# EAGLE design mainboard (EAGLE 8.2.2)
DATABASE: ./../../../../../Components/TinyCircuits_Part_Database.txt
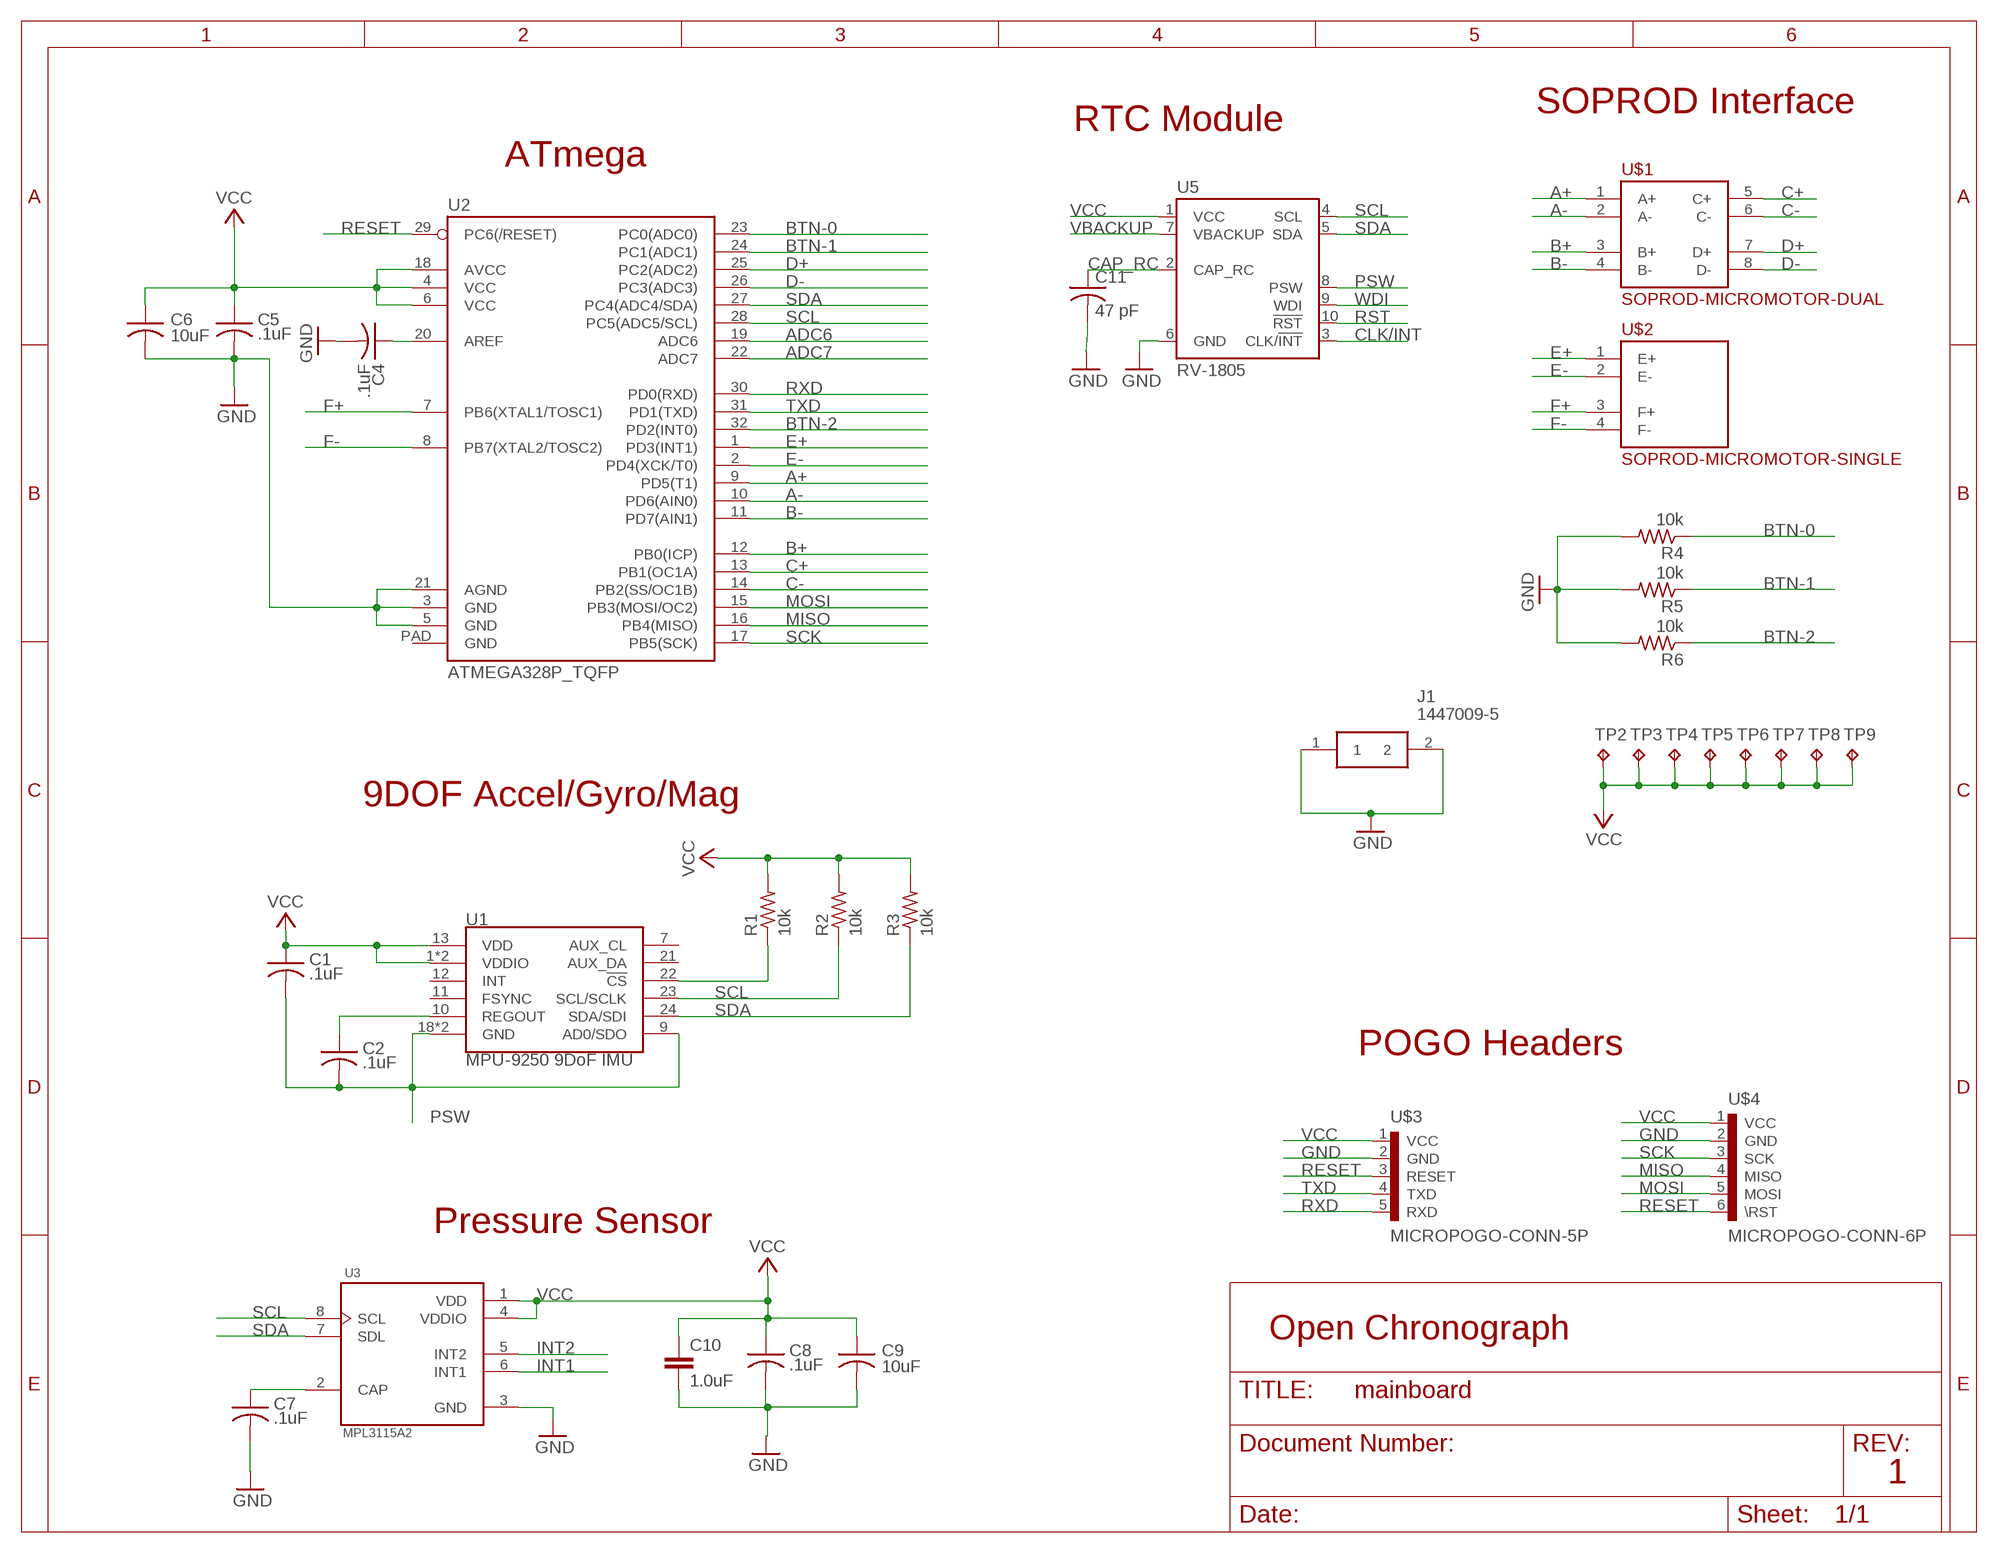
[diagram p0: schematic, sheet 1]

## Parts
C1  .1uF  AS-ITM-00008  [C0402]
C2  .1uF  AS-ITM-00008  [C0402]
C4  .1uF  AS-ITM-00008  [C0402]
C5  .1uF  AS-ITM-00008  [C0402]
C6  10uF  AS-ITM-00002  [C0603]
C7  .1uF  AS-ITM-00008  [C0402]
C8  .1uF  AS-ITM-00008  [C0402]
C9  10uF  AS-ITM-00002  [C0603]
C10  1.0uF  1.0UF-0402-16V-10%  [0402]
C11  47 pF  C-USC0402  [C0402]
J1  1447009-5  [14470095]
R1  10k  R-US_R0402  [R0402]
R2  10k  R-US_R0402  [R0402]
R3  10k  R-US_R0402  [R0402]
R4  10k  R-US_R0402  [R0402]
R5  10k  R-US_R0402  [R0402]
R6  10k  R-US_R0402  [R0402]
TP2  TPTP15SQ  [TP15SQ]
TP3  TPTP15SQ  [TP15SQ]
TP4  TPTP15SQ  [TP15SQ]
TP5  TPTP15SQ  [TP15SQ]
TP6  TPTP15SQ  [TP15SQ]
TP7  TPTP15SQ  [TP15SQ]
TP8  TPTP15SQ  [TP15SQ]
TP9  TPTP15SQ  [TP15SQ]
U1  MPU-9250 9DoF IMU  MPU-9250  [QFN24-3X3]
U2  ATMEGA328P_TQFP  ATMEGA328P_MLFMLF32  [MLF32-PAD]
U3  MPL3115A2  [PSON125P300X500X120-8N]
U5  RV-1805  [RV-1805]
U$1  SOPROD-MICROMOTOR-DUAL  [SOPROD-DUAL]
U$2  SOPROD-MICROMOTOR-SINGLE  [SOPROD-SINGLE]
U$3  MICROPOGO-CONN-5P  [MICROPOGO-CONN-5P-ASYM]
U$4  MICROPOGO-CONN-6P  [MICROPOGO-CONN-6P-ASYM]

## Nets
A+: U2.9(PD5(T1)) U$1.1(A+)
A-: U2.10(PD6(AIN0)) U$1.2(A-)
ADC6: U2.19(ADC6)
ADC7: U2.22(ADC7)
AREF: C4.1 U2.20(AREF)
B+: U2.12(PB0(ICP)) U$1.3(B+)
B-: U2.11(PD7(AIN1)) U$1.4(B-)
BTN-0: R4.1 U2.23(PC0(ADC0))
BTN-1: R5.1 U2.24(PC1(ADC1))
BTN-2: R6.1 U2.32(PD2(INT0))
C+: U2.13(PB1(OC1A)) U$1.5(C+)
C-: U2.14(PB2(SS/OC1B)) U$1.6(C-)
CAP: C7.1 U3.2(CAP)
CAP_RC: C11.1 U5.2(CAP_RC)
CLK/INT: U5.3(CLK/!INT)
D+: U2.25(PC2(ADC2)) U$1.7(D+)
D-: U2.26(PC3(ADC3)) U$1.8(D-)
E+: U2.1(PD3(INT1)) U$2.1(E+)
E-: U2.2(PD4(XCK/T0)) U$2.2(E-)
F+: U2.7(PB6(XTAL1/TOSC1)) U$2.3(F+)
F-: U2.8(PB7(XTAL2/TOSC2)) U$2.4(F-)
GND: C4.2 C5.2 C6.2 C7.2 C8.2 C9.2 C10.2 C11.2 J1.1 J1.2 R4.2 R5.2 R6.2 U2.3(GND) U2.5(GND) U2.21(AGND) U3.3(GND) U5.6(GND) U$3.2(GND) U$4.2(GND)
INT1: U3.6(INT1)
INT2: U3.5(INT2)
MISO: U2.16(PB4(MISO)) U$4.4(MISO)
MOSI: U2.15(PB3(MOSI/OC2)) U$4.5(MOSI)
N$2: C2.1 U1.10(REGOUT)
N$4: R1.1 U1.22(!CS)
PSW: C1.2 C2.2 U1.9(AD0/SDO) U1.18(GND) U1.20(GND) U5.8(PSW)
RESET: U2.29(PC6(/RESET)) U$3.3(RESET) U$4.6(\RST)
RST: U5.10(!RST)
RXD: U2.30(PD0(RXD)) U$3.5(RXD)
SCK: U2.17(PB5(SCK)) U$4.3(SCK)
SCL: R2.1 U1.23(SCL/SCLK) U2.28(PC5(ADC5/SCL)) U3.8(SCL) U5.4(SCL)
SDA: R3.1 U1.24(SDA/SDI) U2.27(PC4(ADC4/SDA)) U3.7(SDL) U5.5(SDA)
TXD: U2.31(PD1(TXD)) U$3.4(TXD)
VBACKUP: U5.7(VBACKUP)
VCC: C1.1 C5.1 C6.1 C8.1 C9.1 C10.1 R1.2 R2.2 R3.2 TP2.TP TP3.TP TP4.TP TP5.TP TP6.TP TP7.TP TP8.TP TP9.TP U1.1(VDDIO) U1.8(VDDIO) U1.13(VDD) U2.4(VCC) U2.6(VCC) U2.18(AVCC) U3.1(VDD) U3.4(VDDIO) U5.1(VCC) U$3.1(VCC) U$4.1(VCC)
WDI: U5.9(WDI)
Unconnected: U1.7(AUX_CL) U1.11(FSYNC) U1.12(INT) U1.21(AUX_DA) U2.PAD(GND)

## Notes on the sheet
- SOPROD Interface
- RTC Module
- ATmega
- 9DOF Accel/Gyro/Mag
- POGO Headers
- Pressure Sensor
- Open Chronograph
- 1

## Library data of the parts
C1 C2 C4 C5 C7 C8 = tinycircuits:AS-ITM-00008: CAP CER 0.1UF 10V 10% X5R 0402; PARTNO: AS-ITM-00008; VALUE: 0.1uF
C6 C9 = tinycircuits:AS-ITM-00002: CAP CER 10UF 10V 20% X5R 0603; PARTNO: AS-ITM-00002
C10 = SparkFun-Capacitors:1.0UF: 1µF ceramic capacitors A capacitor is a passive two-terminal electrical component used to store electrical energy temporarily in an electric field.; PROD_ID: CAP-12417
C11 = adafruit:C-US: CAPACITOR, American symbol
J1 = SamacSys_Parts:1447009-5: EMI Gaskets, Sheets, Absorbers & Shielding 2mm SPRING FINGER Source: Datasheet <https://componentsearchengine.com/Datasheets/1/1447009-5.pdf>; DESCRIPTION: EMI Gaskets, Sheets, Absorbers & Shielding 2mm SPRING FINGER; HEIGHT: 0.9mm; MANUFACTURER_NAME: TE Connectivity; MANUFACTURER_PART_NUMBER: 1447009-5; MOUSER_PART_NUMBER: 571-1447009-5; MOUSER_PRICE-STOCK: https://www.mouser.com/Search/Refine.aspx?Keyword=571-1447009-5
R1-R6 = resistor:R-US_: RESISTOR, American symbol
TP2-TP9 = testpad:TP: Test pad
U1 = SparkFun-Sensors:MPU-9250: MPU-9250 9 Degree of Freedom IMU System in Package that contains MPU-6500 & AK8963 NC pin 19. 2-6 & 14-17 not internally connected. May be used for PCB trace routing. Datasheet <https://cdn.sparkfun.com/assets/learn_tutorials/5/5/0/MPU9250REV1.0.pdf> SparkFun Products: SparkFun 9DoF Razor IMU M0 <https://www.sparkfun.com/products/14001> SparkFun IMU Breakout - MPU-9250 <https://www.sparkfun.com/products/13762>; PROD_ID: IC-13192; VALUE: 9DoF IMU
U2 = SparkFun-IC-Microcontroller:ATMEGA328P_MLF: Datasheet SparkFun Products () () 32-Pin Atmega328 part Commonly used on Arduino compatible boards Available in QFP and QFN packages TQFP is IC-09069 QFN is non-stock
U3 = Common-Parts-Library-Eagle:MPL3115A2: Pressure Sensor, 50-110kpa, Lga-8; MANUFACTURER: Freescale Semiconductor
U5 = SparkFun-Clocks:RV-1805: Micro Crystal Switzerland - RV-1805-C3 - Extremely low power RTC module This RTC IC has been specially designed for ultimate low current consumption of typically 60 nA @ VDD 3.0V for 32.768 kHz XTAL mode. Additionally, there is an RC-Mode consuming only 17nA and an autocalibrated RC-mode consuming 22nA which permits to operate this RTC module several hours at Backup Supply Voltage using low-cost MLCC. The very small SMT ceramic-package combines the 32.768 kHz crystal unit with the CMOS-based oscillator and real-time-clock IC.; PROD_ID: IC-13900
U$1 = OpenChronograph:SOPROD-MICROMOTOR-DUAL
U$2 = OpenChronograph:SOPROD-MICROMOTOR-SINGLE
U$3 = MicroPogo:MICROPOGO-CONN-5P
U$4 = MicroPogo:MICROPOGO-CONN-6P

## Board
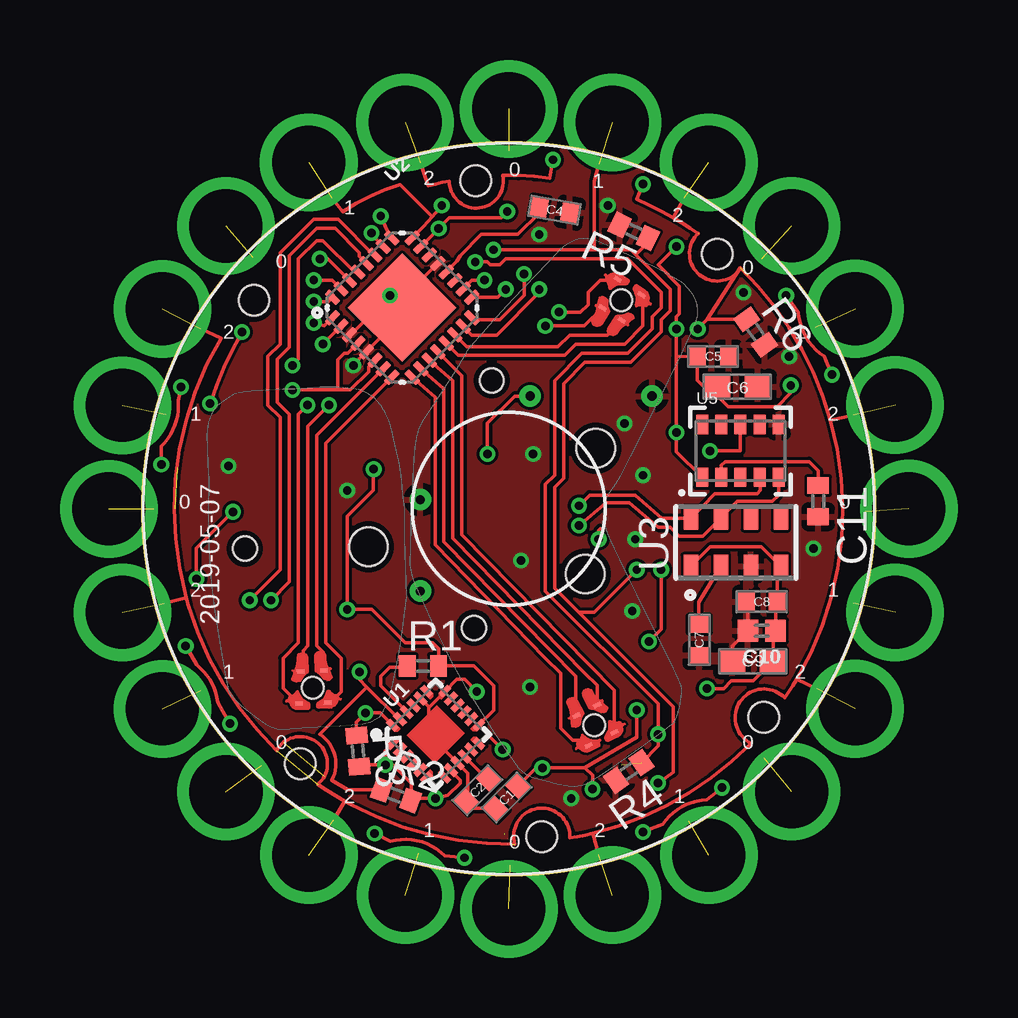
[diagram p1: board, top side]
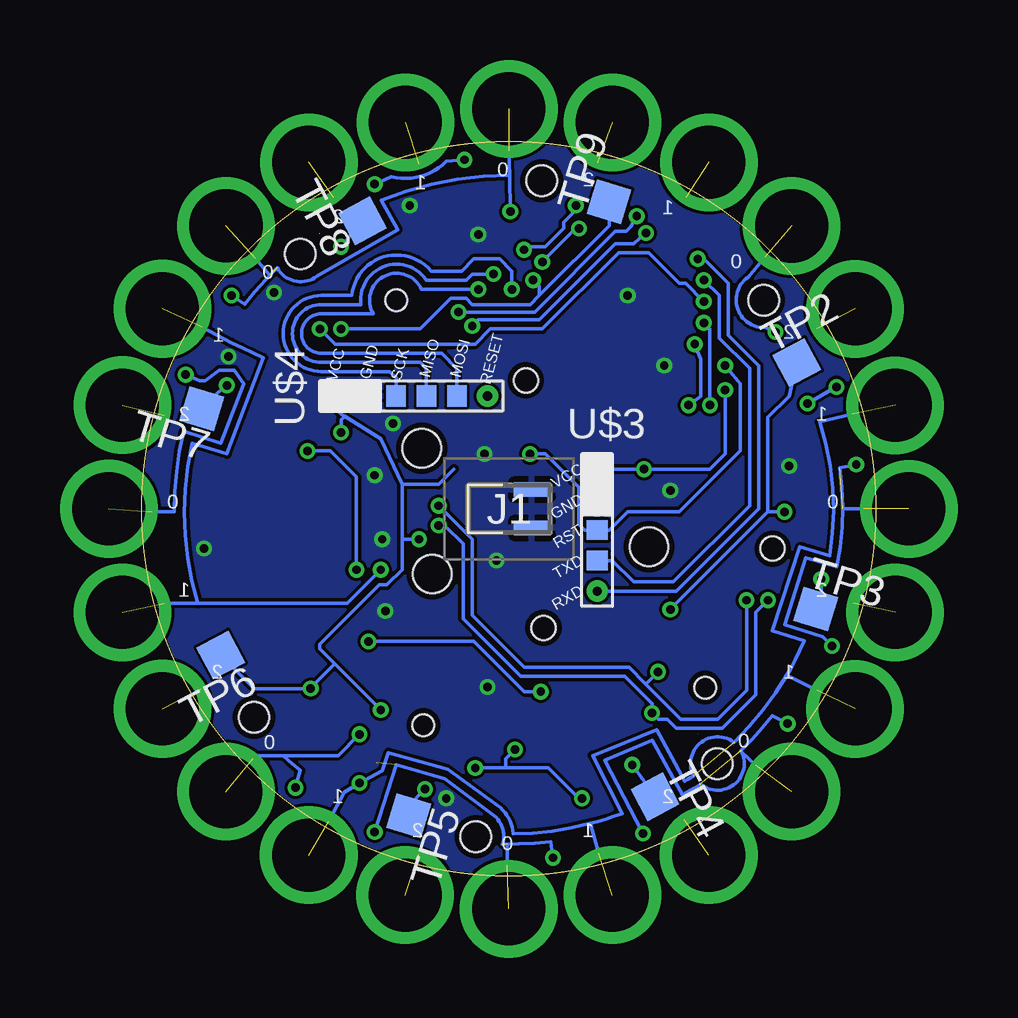
[diagram p2: board, bottom side, seen from below]

No outline drawn. Coordinates in mm, seen from the top.
Copper layers (1*16): Top 0.035mm / dielectric 1.5mm / Bottom 0.035mm
Design rules "dirt_cheap_dirty_boards.v1": minimum track width 5mil, minimum drill 12mil, track to track 5mil, track to pad 5mil, pad to pad 5mil, via to via 5mil, smd to smd 0mil, copper to edge 10mil, drill to drill 10mil, minimum pad ring 10mil, minimum via ring 6mil, stop-mask expansion 2mil, vias tented up to drill 25mil, thermal gap 10mil
Holes 1.27 mm at 25.2,27.13 15.14,30.18 5.89,25.2 7.82,5.89 17.88,2.84 27.13,7.82
bKeepout: area 1.3,1.3 to 31.8,31.8
tRestrict: area 1.3,1.3 to 31.8,31.8
bRestrict: area 1.2,1.2 to 31.8,31.8; area 1.2,1.2 to 31.8,31.8
Milling: area 1.2,1.2 to 31.8,31.8

### Footprints (pad centres in the part's own frame; a part is rotated, then mirrored left to right if it is on the bottom)
C0402 = smd 0.7 x 0.9: 1 -0.65,0; 2 0.65,0
C0603 = smd 1.1 x 1: 1 -0.85,0; 2 0.85,0
0402 = smd 0.85 x 0.9: 1 -0.58,0; 2 0.58,0
14470095 = smd 1.5 x 0.6: 1 -0.75,0.8; 2 -0.75,-0.8
R0402 = smd 0.7 x 0.9: 1 -0.65,0; 2 0.65,0
TP15SQ = smd 1.5 x 1.5: TP 0,0
QFN24-3X3 = smd 0.495 x 0.25: 1 -1.552,1; 6 -1.552,-1; 13 1.552,-1; 18 1.552,1 | smd 0.6 x 0.25: 2 -1.5,0.6; 3 -1.5,0.2; 4 -1.5,-0.2; 5 -1.5,-0.6; 14 1.5,-0.6; 15 1.5,-0.2; 16 1.5,0.2; 17 1.5,0.6 | smd 0.25 x 0.495: 7 -1,-1.552; 12 1,-1.552; 19 1,1.552; 24 -1,1.552 | smd 0.25 x 0.6: 8 -0.6,-1.5; 9 -0.2,-1.5; 10 0.2,-1.5; 11 0.6,-1.5; 20 0.6,1.5; 21 0.2,1.5; 22 -0.2,1.5; 23 -0.6,1.5
MLF32-PAD = smd 0.7 x 0.3: 1 -2.35,1.75; 2 -2.35,1.25; 3 -2.35,0.75; 4 -2.35,0.25; 5 -2.35,-0.25; 6 -2.35,-0.75; 7 -2.35,-1.25; 8 -2.35,-1.75; 17 2.35,-1.75; 18 2.35,-1.25; 19 2.35,-0.75; 20 2.35,-0.25; 21 2.35,0.25; 22 2.35,0.75; 23 2.35,1.25; 24 2.35,1.75 | smd 0.3 x 0.7: 9 -1.75,-2.35; 10 -1.25,-2.35; 11 -0.75,-2.35; 12 -0.25,-2.35; 13 0.25,-2.35; 14 0.75,-2.35; 15 1.25,-2.35; 16 1.75,-2.35; 25 1.75,2.35; 26 1.25,2.35; 27 0.75,2.35; 28 0.25,2.35; 29 -0.25,2.35; 30 -0.75,2.35; 31 -1.25,2.35; 32 -1.75,2.35 | smd 3.2 x 3.2: PAD 0,0
PSON125P300X500X120-8N = smd 0.95 x 0.6: 1 -1,1.875; 2 -1,0.625; 3 -1,-0.625; 4 -1,-1.875; 5 1,-1.875; 6 1,-0.625; 7 1,0.625; 8 1,1.875
RV-1805 = smd 0.5 x 0.8: 1 -1.6,-1.1; 2 -0.8,-1.1; 3 0,-1.1; 4 0.8,-1.1; 5 1.6,-1.1; 6 1.6,1.1; 7 0.8,1.1; 8 0,1.1; 9 -0.8,1.1; 10 -1.6,1.1 | smd 0 x 0: 11 0,0
SOPROD-DUAL = smd 0.305 x 0.152: 1 -0.58,-0.65; 2 -0.47,0.69; 3 0.61,-0.65; 4 0.49,0.69 | smd 0.305 x 0.152 rotated 120: 5 9.903,15.083; 6 8.687,14.508; 7 9.308,16.113; 8 8.207,15.339 | hole 0.9: 0,0; 9.04,15.26 | hole 1.6: 2.533,5.783; 5.3,10.25 | hole 1: 2.723,14.74; -2.617,5.883
SOPROD-SINGLE = smd 0.305 x 0.152: 1 -1.206,-9.468; 2 -1.096,-8.128; 3 -0.136,-8.128; 4 -0.016,-9.468 | hole 0.9: -0.626,-8.818 | hole 1.6: 1.907,-3.035 | hole 1: -3.243,-2.935
MICROPOGO-CONN-5P-ASYM = smd 0.889 x 0.813: 1 0,0; 3 0,-2.54; 4 0,-3.81 | drill 0.381: 2 0,-1.27; 5 0,-5.08
MICROPOGO-CONN-6P-ASYM = smd 0.889 x 0.813: 1 0,3.81; 3 0,1.27; 4 0,0; 5 0,-1.27 | drill 0.381: 2 0,2.54; 6 0,-2.54

### Placement (x,y rotation side)
C1  16.42,4.48 225 top
C2  15.2,4.79 225 top
C4  18.41,28.96 350 top
C5  25.02,22.86 0 top
C6  26.04,21.59 0 top
C7  24.45,11.05 270 top
C8  27.05,12.64 180 top
C9  26.67,10.16 180 top
C10  27.05,11.43 180 top
C11  29.4,16.83 270 top
J1  14.8,16.51 0 bottom
R1  12.93,9.96 0 top
R2  11.81,4.57 340 top
R3  10.22,6.41 275 top
R4  21.51,5.56 215 top
R5  21.72,28.07 155 top
R6  26.8,23.88 305 top
TP2  4.51,22.61 28 bottom
TP3  3.71,12.33 343 bottom
TP4  10.41,4.51 298 bottom
TP5  20.69,3.71 253 bottom
TP6  28.51,10.41 208 bottom
TP7  29.31,20.69 163 bottom
TP8  22.61,28.51 118 bottom
TP9  12.33,29.31 73 bottom
U1  13.46,7.11 45 top
U2  12.06,24.89 45 top
U3  25.97,15.11 90 top
U5  26.16,18.92 0 top
U$1  20.07,7.49 27 top
U$2  8.65,17.89 2 top
U$3  12.83,18.16 0 bottom
U$4  19.94,21.21 90 bottom

### Tracks (layer width: path | path; a pad name or v marks a point on that pad's centre or on a via)
A+
  Top 0.152: 19.88,6.67 20.31,6.86 | 19.88,6.67 U$1.1 | U2.9 13.44,21.17 13.44,15.01 18.03,10.29 18.67,9.65 18.67,7.37 19.18,6.86 19.68,6.86 19.88,6.67
A-
  Top 0.152: 19.32,8.27 19.3,8.5 | 19.32,8.27 U$1.2 | U2.10 13.81,21.51 13.81,15.15 19.3,9.53 19.3,8.28 19.32,8.27
AREF
  Top 0.152: 14.1,26.57 U2.20 14.35,26.82 14.48,27.05 15.37,27.94 16.89,27.94 17.77,28.82 C4.1
B+
  Top 0.152: U2.12 14.55,22.05 14.55,15.42 20.91,8.94 U$1.3
B-
  Top 0.152: U2.11 14.18,21.84 14.18,15.28 19.68,9.65 20.19,9.15 U$1.4
BTN-0  (via drill 0.35, 3.05)  (18 unrouted)
  Top 0.152: U2.23 13.09,27.69 v13.59,28.19 | v15.11,26.8 15.62,26.8 15.75,26.67 16.13,26.67 16.38,26.92 21.46,26.92 22.86,25.53 22.86,24.89 22.48,24.51 22.48,24 21.46,22.99 19.56,22.99 18.41,21.84 18.41,17.91 18.03,17.53 18.03,13.08 22.73,8.38 v22.73,7.11 22.73,6.63 R4.1 | v4.06,20.89 arc-13 v5.4,23.88 | v22.1,3.05 22.92,3.37 arc-54 24.77,4.38 v25.4,4.89 | v28.07,25.4 28.57,24.7 arc53 29.65,22.86 v29.97,22.1 | v2.03,18.35 2.03,19.11 arc51 2.73,21.02 v2.86,21.59 | v3.05,10.79 3.5,10.01 arc-45 4.38,8.45 v4.89,7.56 | v13.59,28.19 13.72,28.32 | v13.59,28.19 14.03,28.64 16.19,28.64 v16.45,28.89 | v10.92,2.98 11.57,2.65 arc-60 13.84,2.06 v14.67,1.97
  Bottom 0.152: v13.59,28.19 13.72,28.19 v15.11,26.8 | v22.73,7.11 23.62,6.22 27.05,6.22 27.15,6.12 | 30.45,16.38 31.37,16.38 | 6.21,5.83 6.84,6.41 | 2.6,16.51 1.71,16.51 | 16.57,2.54 16.57,1.65 | 27.05,26.92 26.47,26.24 | 6.83,6.43 arc156 8.51,5.02 | v5.4,23.88 5.84,24.07 arc148 6.54,26.16 5.84,26.99 | 25.91,6.23 arc-4 25.19,5.61 v25.4,4.89 | 26.16,26.55 arc-8 27.52,25.03 v28.07,25.4 | v29.97,22.1 29.38,21.84 29.15,21.84 28.57,22.29 27.94,22.29 27.56,21.72 28.51,19.24 30.06,19.74 arc-14 30.44,16.38 | 16.77,2.54 arc-8 14.76,2.65 v14.67,1.97 | 6.82,6.45 arc-8 5.53,7.88 v4.89,7.56 | v2.03,18.35 2.72,18.23 arc21 2.85,14.1 4.13,14.48 5.02,11.68 3.43,11.18 v3.05,10.79 | v2.86,21.59 v4.06,20.89 | 26.16,26.54 arc-96 24.5,26.19 21.14,28.13 21.82,29.37 arc22 16.47,30.41 | 16.76,2.54 arc-64 17.11,3.73 19.18,5.27 21.21,5.84 v22.1,3.05 | 8.54,5.03 arc3 9.27,4.57 10.54,6.86 12.51,6.03 v10.92,2.98 | v16.45,28.89 16.47,30.41 | 16.47,30.41 16.51,31.43
  other vias: 28.3,4.73 33.18,16.51 28.29,28.3 16.51,33.18 4.72,28.29 -0.16,16.51 4.73,4.72 16.51,-0.16
BTN-1  (via drill 0.35, 3.05)  (10 unrouted)
  Top 0.152: U2.24 12.95,28.26 13.31,28.68 | 13.31,28.68 v13.72,29.15 | 20.07,27.3 21.59,27.3 21.8,27.09 | 20.07,27.3 v15.88,27.3 | 19.43,12.19 18.41,13.21 18.41,17.4 18.8,17.78 18.8,21.72 19.68,22.61 21.59,22.61 22.86,23.88 22.86,24.38 23.24,24.77 23.24,25.65 21.8,27.09 | 19.43,12.19 20.07,12.19 v21.84,13.97 | R5.1 22.31,27.6 21.8,27.09 | 9.14,29.46 9.59,28.89 arc-16 11.96,30.01 11.98,30.01 13.31,28.68 | 20.07,27.3 20.07,30.16 20.26,30.86 | 19.43,12.19 23.37,8.26 23.37,5.52 v22.73,5.08
  Bottom 0.152: v15.88,27.3 15.75,27.43 14.99,27.43 14.22,28.19 14.22,28.45 13.84,28.83 v13.72,29.15 | 29.27,24.07 28.07,23.43 arc1 26.73,22.8 28.26,18.8 29.71,19.23 arc-30 29.46,12.57 | 29.46,12.57 30.86,12.57 | 13.12,3.4 arc14 16.32,2.96 | 13.12,3.4 12.76,2.16 | 13.12,3.4 12.82,3.48 arc-5 11.79,3.81 13.02,6.22 10.35,7.3 9.18,5.16 arc-1 8.82,5.38 | 4.92,9.58 arc15 7.12,6.78 | 4.92,9.58 3.68,8.95 | 4.92,9.58 4.77,9.84 arc-5 4.2,11.02 5.52,11.43 4.38,14.92 3.14,14.55 arc-28 3.56,20.13 2.22,20.45 | 16.33,2.97 arc-46 16.85,4.04 19.05,5.65 21.53,6.35 21.78,5.59 v22.73,5.08 23.37,4.7 24,3.49 | v21.84,13.97 23.24,12.57 29.46,12.57
  other vias: 32.61,12.2 30.94,24.84 20.82,32.61 8.18,30.94 0.41,20.82 2.08,8.18 12.2,0.41 24.84,2.08
BTN-2  (via drill 0.35, 3.05)  (10 unrouted)
  Top 0.152: U2.32 9,25.15 v8.38,25.15 | v24.38,24 24.79,24.41 | 24.79,24.41 R6.1 | 24.41,27.98 arc5 23.37,28.64 | 26.16,26.54 arc-30 29.91,20.19 | 23.37,28.64 23.81,29.46 | 29.91,20.19 30.86,20.41 | 24.79,24.41 26.16,26.54 | 29.91,20.19 arc-46 28.51,9.4 | 28.51,9.4 29.34,9.02 | 28.51,9.4 arc-4 28,8.64 arc200 26.61,6.73 arc-31 20,2.98 | 20,2.98 20.26,2.1 | 20,2.98 arc-4 19.05,2.79 arc200 16.76,2.54 arc-29 9.94,4.18 9.68,4.33 | 12.83,30.92 13.14,29.97 arc-4 14.03,30.16 arc193 16.26,30.42 arc-8 18.22,30.29 v18.35,31.05 | 3.68,24 4.52,23.62 arc46 3.07,12.81 | 3.07,12.81 2.16,12.57 | 3.07,12.81 3.15,12.49 arc29 6.85,6.43 | 8.57,5.02 arc5 9.68,4.33 | 9.68,4.33 9.21,3.56 | 24.41,27.99 arc196 26.16,26.54 | 23.37,28.64 arc7 21.84,29.4 v22.1,30.04
  Bottom 0.152: v8.38,25.15 9.14,25.91 9.4,25.91 10.67,27.18 11.94,27.18 15.11,24 17.27,24 17.91,23.37 23.75,23.37 v24.38,24 | v18.35,31.05 19.11,30.99 arc60 21.4,30.35 v22.1,30.04
  other vias: 30.94,8.18 32.61,20.82 24.84,30.94 12.2,32.61 2.08,24.84 0.41,12.2 8.18,2.08 20.82,0.41
C+
  Top 0.152: U2.13 14.41,22.9 18.84,22.9 19.3,23.37 21.34,23.37 22.1,24.13 22.1,25.37 U$1.5
C-
  Top 0.152: U2.14 14.76,23.26 18.56,23.26 19.05,23.75 20.61,23.75 U$1.6
CAP
  Top 0.152: C7.1 24.43,12.61 U3.2
CAP_RC
  Top 0.152: U5.2 25.36,18.31 25.53,18.48 29.02,18.48 29.4,18.1 C11.1
D+  (via drill 0.35)
  Top 0.152: U2.25 11.56,27.88 v11.18,28.7 | v18.61,24.7 19.5,24.7 19.81,25.02 19.81,25.53 20.32,26.04 21,26.04 U$1.7
  Bottom 0.152: v18.61,24.7 15.43,24.7 12.06,28.07 11.62,28.07 11.43,28.26 v11.18,28.7
D-  (via drill 0.35)
  Top 0.152: v10.79,28 10.79,27.93 U2.26 | U$1.8 19.66,24.13 v18.03,24.13
  Bottom 0.152: v18.03,24.13 17.78,24.38 15.24,24.38 12.06,27.56 11.3,27.56 v10.79,28
E+  (via drill 0.35)
  Top 0.152: 7.75,8.4 7.7,8.43 7.7,8.55 | 7.75,8.4 U$2.1 | U2.1 8.83,24.13 v8.38,24.26 | v8.13,20.83 7.75,20.45 7.75,10.92 7.11,10.29 7.11,9.04 7.75,8.4
  Bottom 0.152: v8.13,20.83 8.13,24 v8.38,24.26
E-  (via drill 0.35)
  Top 0.152: U$2.2 7.94,10.6 8.13,10.79 8.13,19.94 v9.02,20.83 | U2.2 v8.76,23.37
  Bottom 0.152: v8.76,23.37 8.51,22.73 8.51,21.21 v9.02,20.83
F+
  Top 0.152: U2.7 8.51,19.57 8.51,10.79 8.77,10.53 U$2.3
F-
  Top 0.152: U$2.4 9.06,8.43 9.53,8.89 9.53,10.29 8.89,10.92 8.89,19.24 U2.8
GND  (via drill 0.35)
  Top 0.152: v10.03,22.48 10.03,22.51 U2.5 11.56,24.03 v11.56,25.4 | U2.3 9.92,23.76 v11.56,25.4 | U2.21 12.22,25.4 v11.56,25.4 | C8.2 26.47,12.57 C10.2 25.82,10.78 C9.2 25.65,9.99
  other vias: 9.78,17.27 4.83,18.29 19.11,4.45 17.53,18.8 21.65,12.26 17.4,9.08 21.34,20.07 17.02,14.35 21.78,15.24 22.1,17.91 29.21,14.86 26.29,25.53 28.19,22.86 17.78,27.94 20.64,29.15
  pour Bottom: 0,0 0,34.29 33.02,34.29 33.02,0
  pour Top: 0,0 0,33.02 33.02,33.02 33.02,0
MISO  (via drill 0.35)
  Top 0.152: v17.14,26.29 17.14,25.4 16.13,24.38 15.05,24.38 U2.16
  Bottom 0.152: 17.27,26.29 v17.14,26.29 18.03,26.29 18.29,26.04 19.94,26.04 arc-154 22.67,25.02 24.32,25.02 arc-180 24.32,22.61 20.19,22.61 19.94,22.35 U$4.4
MOSI  (via drill 0.35)
  Top 0.152: U2.15 14.98,23.75 16,23.75 17.78,25.53 v17.78,25.65
  Bottom 0.152: v17.78,25.65 20.16,25.65 arc-186 22.16,24.64 24.32,24.64 arc-180 24.32,22.99 19.3,22.99 18.67,22.35 U$4.5
N$2
  Top 0.152: U1.10 15.24,5.62 C2.1
N$4
  Top 0.152: 12.06,8.23 U1.22 12.26,8.06 11.18,9.14 11.18,9.53 11.56,9.91 12.23,9.91 R1.1
N$5
  Top 0.152: 6.83,6.43 arc-201 8.56,5.03
N$7
  Bottom 0.152: 8.83,5.4 arc153 7.14,6.78
PSW  (via drill 0.35)
  Top 0.152: U5.8 26.16,18.92 v24.89,18.92 | v22.86,13.97 22.86,11.49 v22.35,10.99 | v15.18,8.89 14.67,9.4 14.35,9.4 13.87,8.92 U1.18 13.85,8.9 13.21,8.26 13.18,8.26 | 13.18,8.26 13.17,8.26 U1.20 | 13.18,8.26 13.18,7.11 U1.9 14.8,5.5 14.8,4.33 C2.2 14.74,4.02 C1.2
  Bottom 0.152: v24.89,18.92 23.94,18.92 22.86,17.84 v22.86,13.97 | v22.35,10.99 17.97,10.99 15.88,8.89 v15.18,8.89
RESET  (via drill 0.35)
  Top 0.152: 10.2,26.38 U2.29 10.07,26.38 8.76,27.69 8.51,27.69 7.75,26.92 7.75,22.73 v7.49,22.48 | U$4.6 16.76,21.21 15.62,20.07 v15.62,18.8
  Bottom 0.152: v7.49,22.48 6.86,21.72 6.86,18.92 9.4,16.38 11.56,16.38 12.32,15.62 U$3.3 13.34,15.62 13.59,15.88 13.59,17.4 14.99,18.8 v15.62,18.8
RXD  (via drill 0.35)
  Top 0.152: U2.30 8.97,26.92 v8.64,26.92
  Bottom 0.152: v8.64,26.92 8.38,26.92 7.37,25.91 7.37,23.75 6.1,22.48 6.1,16.51 9.53,13.08 U$3.5
SCK  (via drill 0.35)
  Top 0.152: v16.38,25.65 16.05,25.32 U2.17
  Bottom 0.152: v16.38,25.65 16.38,26.42 16.89,26.92 17.97,26.92 18.48,26.42 19.75,26.42 arc-134 23.05,25.4 24.32,25.4 arc-180 24.32,22.23 21.46,22.23 21.21,21.97 U$4.3
SCL  (via drill 0.35)  (1 unrouted)
  Top 0.152: U2.28 10.29,27.02 10.29,27.18 9.27,28.19 8.51,28.19 7.37,27.05 7.37,23.24 6.86,22.73 6.86,20.95 7.37,20.45 7.37,13.46 v6.6,12.7 | 11.35,5.13 R2.1 9.81,4.79 9.14,5.21 arc84 8.64,7.11 | U1.23 11.94,7.75 10.6,9.08 | U5.4 26.99,17.8 26.99,17.27 26.86,17.14 25.08,17.14 24.11,16.11 U3.8 22.88,16.11 21.78,17.08 19.88,17.08 v19.43,16.64 | v10.29,9.72 10.29,9.4 10.6,9.08 | 8.64,7.12 10.6,9.08
  Bottom 0.152: v19.43,16.64 18.03,15.24 18.03,12.06 15.88,9.91 11.49,9.91 10.83,9.25 | v10.29,9.72 10.76,9.25 10.83,9.25 | v6.6,12.7 6.6,8.95 7.81,7.75 9.34,7.75 10.83,9.25
SDA  (via drill 0.35)
  Top 0.152: U2.27 10.89,27.08 9.4,28.57 8.38,28.57 6.99,27.18 6.99,23.37 6.48,22.86 6.48,20.83 6.99,20.32 6.99,13.97 v5.71,12.7 | U1.24 11.16,8 v10.54,8 10.16,7.62 R3.1 | v19.43,15.81 20.57,16.76 21.53,16.76 22.73,15.75 23.24,15.75 23.62,15.37 24.6,15.37 U3.7 25.35,16.14 26.04,16.83 27.5,16.83 27.75,17.08 27.75,17.75 U5.5
  Bottom 0.152: v19.43,15.81 19.18,15.81 18.41,15.05 18.41,11.94 16,9.53 11.68,9.53 10.54,8.38 v10.54,8 v10.53,8 10.28,7.75 9.91,7.75 9.53,7.37 7.62,7.37 6.22,8.76 6.22,12.19 v5.71,12.7
TXD  (via drill 0.35)
  Top 0.152: 9.41,25.78 U2.31 9.15,26.04 v8.38,26.04
  Bottom 0.152: v8.38,26.04 7.75,25.4 7.75,23.62 7.74,23.62 6.48,22.36 6.48,16.64 9.65,13.46 11.3,13.46 12.19,14.35 U$3.4
VCC  (via drill 0.35)
  Top 0.152: U2.18 14.98,26.04 v15.49,26.04 | U2.4 9.81,22.99 9.65,22.99 9.39,22.72 9.39,21.46 | U2.6 10.67,22.43 10.67,22.23 9.91,21.46 9.39,21.46 | v16.26,6.48 15.27,7.47 U1.13 15.88,8.11 15.88,9.14 15.06,9.96 13.63,9.96 | U1.8 14.1,5.59 14.48,5.21 14.48,5.08 13.97,4.57 v13.46,4.45 12.48,4.45 | 9.39,21.46 v7.49,21.46 | 23.5,22.85 v23.5,24 23.5,24.51 23.62,24.64 23.62,25.78 22.73,26.67 v23.5,27.43 | 13.63,9.96 R1.2 | 23.5,22.85 C5.1 24.37,21.86 24.64,21.59 C6.1 25.18,21.23 25.65,20.77 27.69,20.77 28.26,21.34 v28.26,21.65 | 12.48,4.45 R2.2 | 13.63,9.96 13.59,10 13.59,10.67 13.34,10.92 12.19,10.92 10.79,12.32 v9.78,12.32 9.78,16.19 10.86,17.27 10.86,18.14 v10.88,18.16 | 12.48,4.45 12.45,4.47 12.45,5.08 11.68,5.84 v11.37,5.84 v11.37,5.85 | C1.1 17.65,5.71 v17.91,5.71 19.68,5.71 | 19.68,5.71 21.84,6.99 v21.84,8.13 | v20.26,15.24 20.26,15.62 20.32,15.68 | U3.1 24.91,14.92 27.04,14.92 U3.4 27.7,13.97 C8.1 27.63,12.57 C10.1 27.52,11.32 C9.1 26.7,9.34 25.78,9.34 25.46,9.02 v24.77,9.02 | 19.68,5.71 20,5.4 v20,4.83 | v11.37,5.85 11.37,6.43 U1.1 | R3.2 10.28,5.85 v11.37,5.85 | v5.02,16.38 3.49,14.86 v3.49,13.59 | 23.5,22.85 v23.5,19.68 23.5,18.89 U5.1
  Bottom 0.152: 16.64,5.71 16.64,6.1 v16.26,6.48 | 16.64,5.71 14.86,5.71 13.59,4.45 v13.46,4.45 | 20.95,17.53 21.84,19.43 23.35,20.36 | 20.95,15.24 20.95,17.53 | v23.5,24 20.19,24 18.92,25.27 18.29,25.27 18.03,25.02 15.62,25.02 15.24,25.4 | 23.35,20.36 23.5,20.45 23.75,20.7 U$4.1 | v7.49,21.46 7.49,18.8 8.13,18.16 v10.88,18.16 U$3.1 | 18.8,18.16 19.43,17.53 20.95,17.53 | v17.91,5.71 16.64,5.71 | v15.49,26.04 15.24,25.78 15.24,25.4 | v9.78,12.32 5.71,16.38 | 5.71,16.38 5.71,20.32 4.83,21.21 TP2.TP | 20.95,15.24 v20.26,15.24 | 20.95,15.24 20.95,13.97 21.59,13.34 21.91,13.34 24.38,10.86 24.38,10.67 23.76,10.05 | 23.76,10.05 v21.84,8.13 | 23.76,10.05 24.77,9.05 v24.77,9.02 27.11,9.02 TP6.TP | 15.24,25.4 12.33,28.31 TP9.TP | v23.5,27.43 TP8.TP | v28.26,21.65 28.64,21.35 TP7.TP | v20,4.83 20.69,4.14 TP5.TP | v11.37,5.84 TP4.TP | 5.71,16.38 v5.02,16.38 | v3.49,13.59 3.49,12.33 TP3.TP | v23.5,19.68 23.5,20.21 23.35,20.36
(copper drawn outside any net)
  shapes: Top area x1

### Text on the board
tNames: 2 | 0 | 1 | 1 | 2 | 0 | 0 | 2 | 1 | 1 | 2 | 0 | 0 | 2 | 1 | 2019-05-07 | 1 | 2 | 0 | 0 | 2 | 1 | 1 | 2 | 0
bNames: 2 | 0 | 1 | 1 | 2 | 0 | 0 | 2 | RESET | MOSI | MISO | SCK | GND | VCC | 1 | 1 | 2 | VCC | 0 | GND | 0 | RST | TXD | 2 | RXD | 1 | 1 | 2 | 0 | 0 | 2 | 1 | 1 | 2 | 0